# Altium schematic sheet Safe.SchDoc
size A2
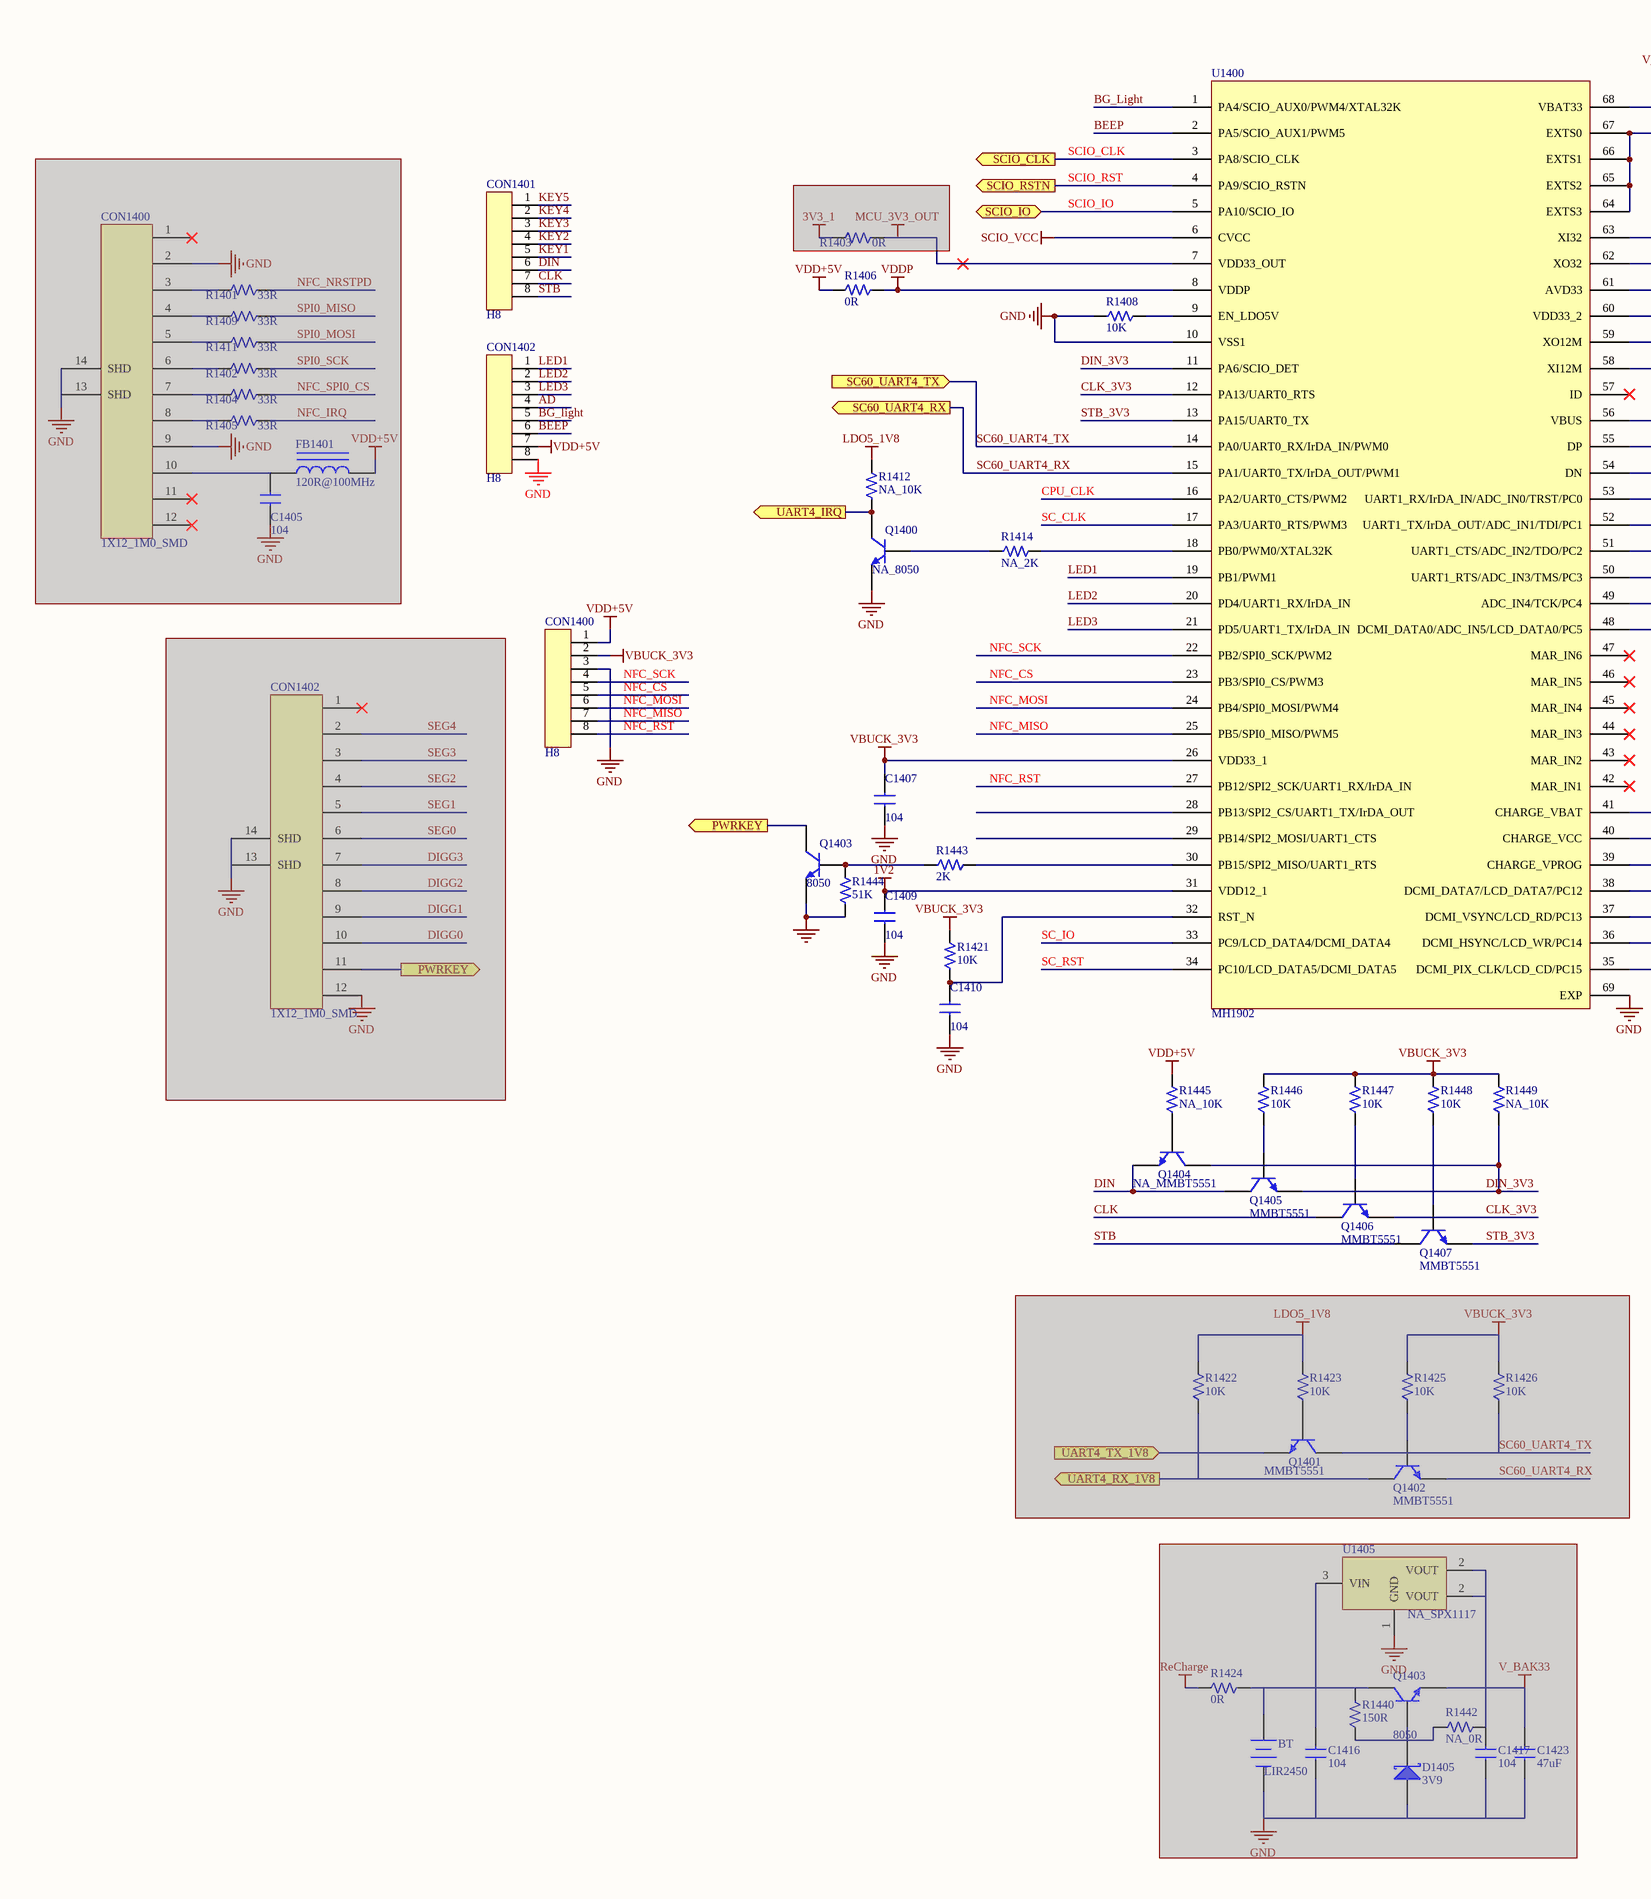
[diagram p0: Safe.SchDoc, left]
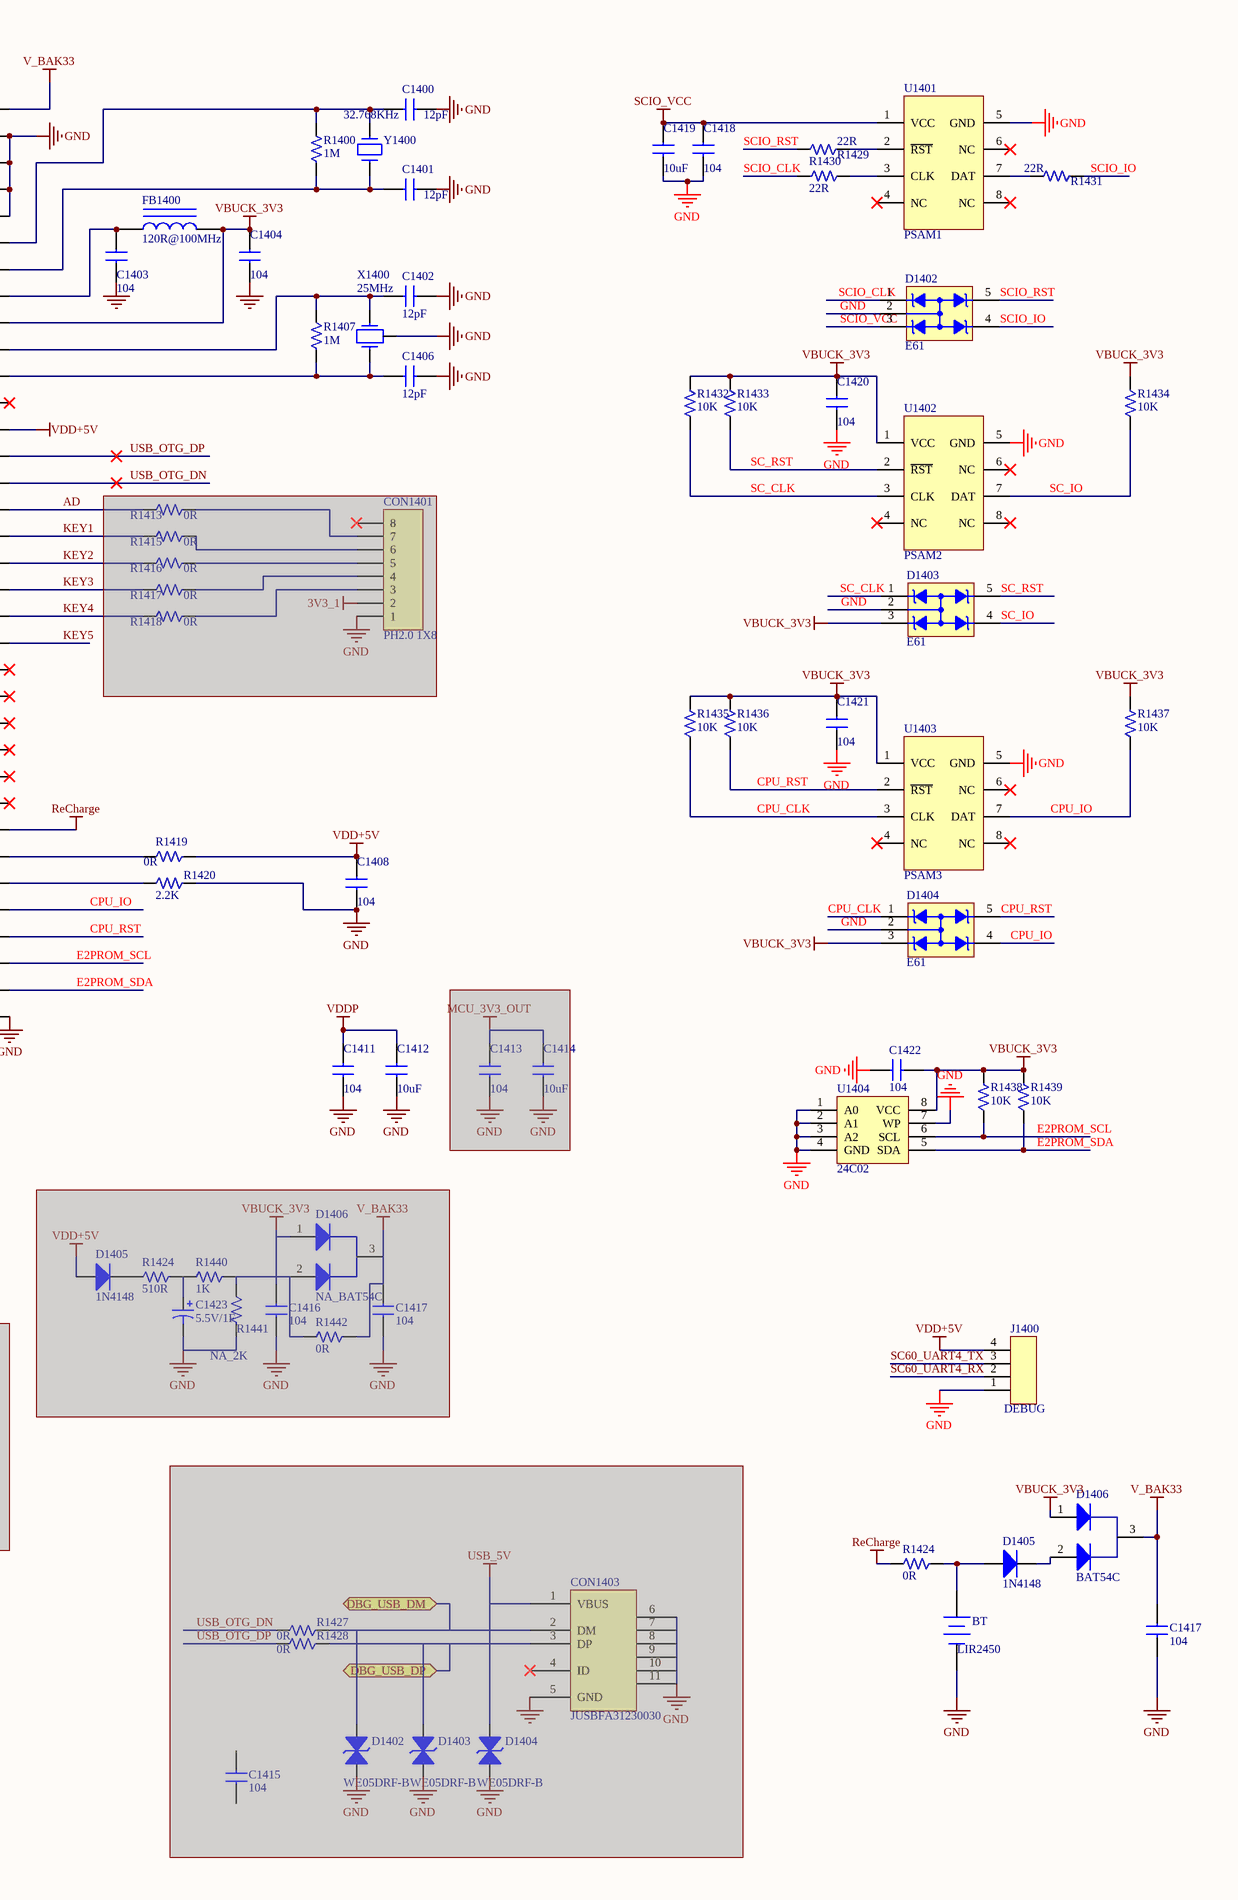
[diagram p1: Safe.SchDoc, right]

## Parts
(Parts that share a designator on the sheet are numbered #1, #2 ... from top to bottom, then left to right.)
BT#1  LIR2450  [LIR2450]
BT#2  LIR2450  [BAT-2]  (masked out: inside a compile mask, not in the netlist)
C1400  12pF  [C0603]
C1401  12pF  [C0603]
C1402  12pF  [C0603]
C1403  104  [C0603]
C1404  104  [C0603]
C1405  104  [C0603]  (masked out: inside a compile mask, not in the netlist)
C1406  12pF  [C0603]
C1407  104  [C0603]
C1408  104  [C0603]
C1409  104  [C0603]
C1410  104  [C0603]
C1411  104  [C0603]
C1412  10uF  [C0603]
C1413  104  [C0603]  (masked out: inside a compile mask, not in the netlist)
C1414  10uF  [C0603]  (masked out: inside a compile mask, not in the netlist)
C1415  104  [C0603]  (masked out: inside a compile mask, not in the netlist)
C1416#1  104  [C0603]  (masked out: inside a compile mask, not in the netlist)
C1416#2  104  [C0603]  (masked out: inside a compile mask, not in the netlist)
C1417#1  104  [C0603]  (masked out: inside a compile mask, not in the netlist)
C1417#2  104  [C0603]
C1417#3  104  [C0603]  (masked out: inside a compile mask, not in the netlist)
C1418  104  [C0603]
C1419  10uF  [C0603]
C1420  104  [C0603]
C1421  104  [C0603]
C1422  104  [C0603]
C1423#1  5.5V/1F  [KAMCAP20.7*7.4_6mm]  (masked out: inside a compile mask, not in the netlist)
C1423#2  47uF  [C0805]  (masked out: inside a compile mask, not in the netlist)
CON1400#1  1X12_1M0_SMD  (masked out: inside a compile mask, not in the netlist)
CON1400#2  H8  [1.25-8P-LT]
CON1401#1  H8  [1.25-8P-LT]
CON1401#2  PH2.0 1X8  [HDR1X8]  (masked out: inside a compile mask, not in the netlist)
CON1402#1  H8  [1.25-8P-LT]
CON1402#2  1X12_1M0_SMD  (masked out: inside a compile mask, not in the netlist)
CON1403  JUSBFA31230030  (masked out: inside a compile mask, not in the netlist)
D1402#1  E61  [SOT23-5]
D1402#2  WE05DRF-B  [DO-214AB(SMC)]  (masked out: inside a compile mask, not in the netlist)
D1403#1  E61  [SOT23-5]
D1403#2  WE05DRF-B  [DO-214AB(SMC)]  (masked out: inside a compile mask, not in the netlist)
D1404#1  E61  [SOT23-5]
D1404#2  WE05DRF-B  [DO-214AB(SMC)]  (masked out: inside a compile mask, not in the netlist)
D1405#1  1N4148  [LL-34]  (masked out: inside a compile mask, not in the netlist)
D1405#2  1N4148  [LL-34]
D1405#3  3V9  [LL-34]  (masked out: inside a compile mask, not in the netlist)
D1406#1  NA_BAT54C  [SOT-23]  (masked out: inside a compile mask, not in the netlist)
D1406#2  BAT54C  [SOT-23]
FB1400  120R@100MHz  [R0603]
FB1401  120R@100MHz  [R0603]  (masked out: inside a compile mask, not in the netlist)
J1400  DEBUG  [Hs4_2.0]
Q1400  NA_8050  [SOT-23]
Q1401  MMBT5551  [SOT-23]  (masked out: inside a compile mask, not in the netlist)
Q1402  MMBT5551  [SOT-23]  (masked out: inside a compile mask, not in the netlist)
Q1403#1  8050  [SOT-23]
Q1403#2  8050  [SOT-23]  (masked out: inside a compile mask, not in the netlist)
Q1404  NA_MMBT5551  [SOT-23]
Q1405  MMBT5551  [SOT-23]
Q1406  MMBT5551  [SOT-23]
Q1407  MMBT5551  [SOT-23]
R1400  1M  [R0603]
R1401  33R  [R0603]  (masked out: inside a compile mask, not in the netlist)
R1402  33R  [R0603]  (masked out: inside a compile mask, not in the netlist)
R1403  0R  [R0603]  (masked out: inside a compile mask, not in the netlist)
R1404  33R  [R0603]  (masked out: inside a compile mask, not in the netlist)
R1405  33R  [R0603]  (masked out: inside a compile mask, not in the netlist)
R1406  0R  [R0603]
R1407  1M  [R0603]
R1408  10K  [R0603]
R1409  33R  [R0603]  (masked out: inside a compile mask, not in the netlist)
R1411  33R  [R0603]  (masked out: inside a compile mask, not in the netlist)
R1412  NA_10K  [R0603]
R1413  0R  [R0603]  (masked out: inside a compile mask, not in the netlist)
R1414  NA_2K  [R0603]
R1415  0R  [R0603]  (masked out: inside a compile mask, not in the netlist)
R1416  0R  [R0603]  (masked out: inside a compile mask, not in the netlist)
R1417  0R  [R0603]  (masked out: inside a compile mask, not in the netlist)
R1418  0R  [R0603]  (masked out: inside a compile mask, not in the netlist)
R1419  0R  [R0603]
R1420  2.2K  [R0603]
R1421  10K  [R0603]
R1422  10K  [R0603]  (masked out: inside a compile mask, not in the netlist)
R1423  10K  [R0603]  (masked out: inside a compile mask, not in the netlist)
R1424#1  510R  [R0603]  (masked out: inside a compile mask, not in the netlist)
R1424#2  0R  [R0603]
R1424#3  0R  [R0603]  (masked out: inside a compile mask, not in the netlist)
R1425  10K  [R0603]  (masked out: inside a compile mask, not in the netlist)
R1426  10K  [R0603]  (masked out: inside a compile mask, not in the netlist)
R1427  0R  [R0603]  (masked out: inside a compile mask, not in the netlist)
R1428  0R  [R0603]  (masked out: inside a compile mask, not in the netlist)
R1429  22R  [R0603]
R1430  22R  [R0603]
R1431  22R  [R0603]
R1432  10K  [R0603]
R1433  10K  [R0603]
R1434  10K  [R0603]
R1435  10K  [R0603]
R1436  10K  [R0603]
R1437  10K  [R0603]
R1438  10K  [R0603]
R1439  10K  [R0603]
R1440#1  1K  [R0603]  (masked out: inside a compile mask, not in the netlist)
R1440#2  150R  [R0603]  (masked out: inside a compile mask, not in the netlist)
R1441  NA_2K  [R0603]  (masked out: inside a compile mask, not in the netlist)
R1442#1  0R  [R0603]  (masked out: inside a compile mask, not in the netlist)
R1442#2  NA_0R  [R0603]  (masked out: inside a compile mask, not in the netlist)
R1443  2K  [R0603]
R1444  51K  [R0603]
R1445  NA_10K  [R0603]
R1446  10K  [R0603]
R1447  10K  [R0603]
R1448  10K  [R0603]
R1449  NA_10K  [R0603]
U1400  MH1902  [QFN68]
U1401  PSAM1  [PSAM/SIM]
U1402  PSAM2  [PSAM/SIM]
U1403  PSAM3  [PSAM/SIM]
U1404  24C02  [SO127P-390-8]
U1405  NA_SPX1117  [SOT-223]  (masked out: inside a compile mask, not in the netlist)
X1400  25MHz  [XTAL3225_SMT]
Y1400  32.768KHz  [XTAL3215_SMT]

## Ports
DBG_USB_DM (bidir), DBG_USB_DP (bidir), PWRKEY (out), SC60_UART4_RX (out), SC60_UART4_TX (in), SCIO_CLK (out), SCIO_IO (bidir), SCIO_RSTN (out), UART4_IRQ (out), UART4_RX_1V8 (out), UART4_TX_1V8 (in)

## Nets
1V2: C1409.2 U1400.31(VDD12_1)
GND: BT#1.2(-) C1400.2 C1401.2 C1402.2 C1403.1 C1404.1 C1406.2 C1407.1 C1408.1 C1409.1 C1410.1 C1411.1 C1412.1 C1417#2.2 C1418.1 C1419.1 C1420.1 C1421.1 C1422.2 CON1400#2.3 CON1402#1.8 D1402#1.2 D1403#1.2 D1404#1.2 J1400.1 Q1400.2(E) Q1403#1.2(E) R1408.1 R1420.1 R1444.1 U1400.10(VSS1) U1400.64(EXTS3) U1400.65(EXTS2) U1400.66(EXTS1) U1400.67(EXTS0) U1400.69(EXP) U1401.5(GND) U1402.5(GND) U1403.5(GND) U1404.1(A0) U1404.2(A1) U1404.3(A2) U1404.4(GND) U1404.7(WP) X1400.2(GND)
LDO5_1V8: R1412.2
ReCharge: R1424#2.2 U1400.41(CHARGE_VBAT)
SCIO_VCC: C1418.2 C1419.2 D1402#1.3 U1400.6(CVCC) U1401.1(VCC)
V_BAK33: C1417#2.1 D1406#2.3(K) U1400.68(VBAT33)
VBUCK_3V3: C1404.2 C1407.2 C1420.2 C1421.2 C1422.1 CON1400#2.2 D1403#1.3 D1404#1.3 D1406#2.1(A) FB1400.2 R1421.2 R1432.1 R1433.1 R1434.1 R1435.1 R1436.1 R1437.1 R1438.1 R1439.1 R1446.2 R1447.2 R1448.2 R1449.2 U1400.26(VDD33_1) U1400.60(VDD33_2) U1402.1(VCC) U1403.1(VCC) U1404.8(VCC)
VDD+5V: C1408.2 CON1400#2.1 CON1402#1.7 J1400.4 R1406.2 R1419.1 R1445.2 U1400.56(VBUS)
VDDP: C1411.2 C1412.2 R1406.1 U1400.8(VDDP)
AD: CON1402#1.4 U1400.53(UART1_RX/IrDA_IN/ADC_IN0/TRST/PC0)
BEEP: CON1402#1.6 U1400.2(PA5/SCIO_AUX1/PWM5)
BG_Light: CON1402#1.5 U1400.1(PA4/SCIO_AUX0/PWM4/XTAL32K)
CLK: CON1401#1.7 Q1406.3(C)
CLK_3V3: Q1406.2(E) U1400.12(PA13/UART0_RTS)
CPU_CLK: D1404#1.1 R1435.2 U1400.16(PA2/UART0_CTS/PWM2) U1403.3(CLK)
CPU_IO: D1404#1.4 R1437.2 U1400.38(DCMI_DATA7/LCD_DATA7/PC12) U1403.7(DAT)
CPU_RST: D1404#1.5 R1436.2 U1400.37(DCMI_VSYNC/LCD_RD/PC13) U1403.2(~{RST})
DIN: CON1401#1.6 Q1404.2(E) Q1405.3(C)
DIN_3V3: Q1404.3(C) Q1405.2(E) R1449.1 U1400.11(PA6/SCIO_DET)
E2PROM_SCL: R1438.2 U1400.36(DCMI_HSYNC/LCD_WR/PC14) U1404.6(SCL)
E2PROM_SDA: R1439.2 U1400.35(DCMI_PIX_CLK/LCD_CD/PC15) U1404.5(SDA)
KEY1: CON1401#1.5 U1400.52(UART1_TX/IrDA_OUT/ADC_IN1/TDI/PC1)
KEY2: CON1401#1.4 U1400.51(UART1_CTS/ADC_IN2/TDO/PC2)
KEY3: CON1401#1.3 U1400.50(UART1_RTS/ADC_IN3/TMS/PC3)
KEY4: CON1401#1.2 U1400.49(ADC_IN4/TCK/PC4)
KEY5: CON1401#1.1 U1400.48(DCMI_DATA0/ADC_IN5/LCD_DATA0/PC5)
LED1: CON1402#1.1 U1400.19(PB1/PWM1)
LED2: CON1402#1.2 U1400.20(PD4/UART1_RX/IrDA_IN)
LED3: CON1402#1.3 U1400.21(PD5/UART1_TX/IrDA_IN)
NFC_CS: CON1400#2.5 U1400.23(PB3/SPI0_CS/PWM3)
NFC_MISO: CON1400#2.7 U1400.25(PB5/SPI0_MISO/PWM5)
NFC_MOSI: CON1400#2.6 U1400.24(PB4/SPI0_MOSI/PWM4)
NFC_RST: CON1400#2.8 U1400.27(PB12/SPI2_SCK/UART1_RX/IrDA_IN)
NFC_SCK: CON1400#2.4 U1400.22(PB2/SPI0_SCK/PWM2)
PWRKEY: Q1403#1.3(C) ; port PWRKEY
SC60_UART4_RX: J1400.2 U1400.15(PA1/UART0_TX/IrDA_OUT/PWM1) ; port SC60_UART4_RX
SC60_UART4_TX: J1400.3 U1400.14(PA0/UART0_RX/IrDA_IN/PWM0) ; port SC60_UART4_TX
SC_CLK: D1403#1.1 R1432.2 U1400.17(PA3/UART0_RTS/PWM3) U1402.3(CLK)
SC_IO: D1403#1.4 R1434.2 U1400.33(PC9/LCD_DATA4/DCMI_DATA4) U1402.7(DAT)
SC_RST: D1403#1.5 R1433.2 U1400.34(PC10/LCD_DATA5/DCMI_DATA5) U1402.2(~{RST})
SCIO_CLK: D1402#1.1 R1430.1 U1400.3(PA8/SCIO_CLK) ; port SCIO_CLK
SCIO_IO: D1402#1.4 R1431.1 U1400.5(PA10/SCIO_IO) ; port SCIO_IO
SCIO_RST: D1402#1.5 R1429.2 U1400.4(PA9/SCIO_RSTN) ; port SCIO_RSTN
STB: CON1401#1.8 Q1407.3(C)
STB_3V3: Q1407.2(E) U1400.13(PA15/UART0_TX)
UART4_IRQ: Q1400.3(C) R1412.1 ; port UART4_IRQ
USB_OTG_DN: U1400.54(DN)
USB_OTG_DP: U1400.55(DP)
NetBT#1_1: BT#1.1(+) D1405#2.1(A) R1424#2.1
NetC1400_1: C1400.1 R1400.2 U1400.63(XI32) Y1400.2
NetC1401_1: C1401.1 R1400.1 U1400.62(XO32) Y1400.1
NetC1402_1: C1402.1 R1407.2 U1400.59(XO12M) X1400.1
NetC1403_2: C1403.2 FB1400.1 U1400.61(AVD33)
NetC1406_1: C1406.1 R1407.1 U1400.58(XI12M) X1400.3
NetC1410_2: C1410.2 R1421.1 U1400.32(RST_N)
NetD1405#2_2: D1405#2.2(K) D1406#2.2(A)
NetQ1400_1: Q1400.1(B) R1414.1
NetQ1403#1_1: Q1403#1.1(B) R1443.1 R1444.2
NetQ1404_1: Q1404.1(B) R1445.1
NetQ1405_1: Q1405.1(B) R1446.1
NetQ1406_1: Q1406.1(B) R1447.1
NetQ1407_1: Q1407.1(B) R1448.1
NetR1408_2: R1408.2 U1400.9(EN_LDO5V)
NetR1414_2: R1414.2 U1400.18(PB0/PWM0/XTAL32K)
NetR1419_2: R1419.2 U1400.40(CHARGE_VCC)
NetR1420_2: R1420.2 U1400.39(CHARGE_VPROG)
NetR1429_1: R1429.1 U1401.2(~{RST})
NetR1430_2: R1430.2 U1401.3(CLK)
NetR1431_2: R1431.2 U1401.7(DAT)
NetR1443_2: R1443.2 U1400.30(PB15/SPI2_MISO/UART1_RTS)

Not connected (* = marked no-connect by the designer): U1400 7(VDD33_OUT)* 28(PB13/SPI2_CS/UART1_TX/IrDA_OUT) 29(PB14/SPI2_MOSI/UART1_CTS) 42(MAR_IN1)* 43(MAR_IN2)* 44(MAR_IN3)* 45(MAR_IN4)* 46(MAR_IN5)* 47(MAR_IN6)* 57(ID)*; U1401 4(NC)* 6(NC)* 8(NC)*; U1402 4(NC)* 6(NC)* 8(NC)*; U1403 4(NC)* 6(NC)* 8(NC)*

## Library data of the parts
BT#1 BT#2 = Battery: Multicell Battery; Published: 24-Mar-1999; LatestRevisionDate: 17-Jul-2002; LatestRevisionNote: Re-released for DXP Platform.; PackageReference: BAT-2; Publisher: Altium Limited; PackageDescription: Battery; 2 Leads
C1400-C1415 C1416#1 C1416#2 C1417#1-C1417#3 C1418-C1422 C1423#2 = C: Capacitance
C1423#1 = Cap Pol: Polarized Capacitor; Value: 476A; Published: 8-Jun-2000; LatestRevisionDate: 17-Jul-2002; LatestRevisionNote: Re-released for DXP Platform.; PackageReference: RB7.6-15; Publisher: Altium Limited
CON1401#2 = Header 8: Header, 8-Pin; LatestRevisionDate: 17-Jul-2002; LatestRevisionNote: Re-released for DXP Platform.; Publisher: Altium Limited
D1402#1 D1403#1 D1404#1 = ESDA6V1W5(E61)
D1402#2 D1403#2 D1404#2 = TVS: Transient Voltage Suppressor; Part No.: BK0012019
D1405#1 D1405#2 = D1: Manufacturer: Generic Components; Class: Discrete; SubClass: Diode - Switching; Published: 08/06/2000; Publisher: Altium Hobart Technology Centre
D1405#3 = Diode BAS70: Silicon AF Schottky Diode for High-Speed Switching; Note: Pin 2 is not connected and not drawn.; Published: 21-Mar-2003; LatestRevisionDate: 29-May-2009; LatestRevisionNote: IPC-7351 Footprint Added.; DatasheetVersion: Oct-1999; PackageVersion: Sep-2001; PackageReference: SOT-23; Publisher: Altium Limited; PackageDescription: 3-Pin SOT-23 Package 0.95 mm Pitch, 2.5 mm Lead Span; ComponentLink1Description: Manufacturer Link; ComponentLink1URL: http://www.infineon.com/; ComponentLink2Description: Datasheet; ComponentLink2URL: http://www.infineon.com/upload/Document/cmc_upload/documents/009/382/bas40_bas140series_1.pdf
D1406#1 = BAT54C
FB1400 FB1401 = Inductor Iron: Magnetic-Core Inductor; Value: 10mH; Published: 24-Mar-1999; LatestRevisionDate: 17-Jul-2002; LatestRevisionNote: Re-released for DXP Platform.; PackageReference: AXIAL-0.9; Publisher: Altium Limited; PackageDescription: Axial Device, Thru-Hole; 2 Leads; 0.9 in Pin Spacing
J1400 = H4
Q1400-Q1402 Q1403#1 Q1403#2 Q1404-Q1407 = 2N3904: NPN General Purpose Amplifier; Published: 8-Jun-2000; LatestRevisionDate: 15-Jan-2003; LatestRevisionNote: PCB Footprint 'BCY-W3/D4.7' replaced; DatasheetVersion: 1997; PackageVersion: Sep-1998; PackageReference: TO-92A; Publisher: Altium Limited; PackageDescription: TO, Flat Index; 3 In-Line, Axial Leads; Body Dia. 4.5mm; Leads 0.51 x 0.48 mm (max); ComponentLink1Description: Manufacturer Link; ComponentLink1URL: http://www.fairchildsemi.com/; ComponentLink2Description: Datasheet; ComponentLink2URL: http://www.fairchildsemi.com/ds/2N%2F2N3904.pdf
R1400-R1409 R1411-R1423 R1424#1-R1424#3 R1425-R1439 R1440#1 R1440#2 R1441 R1442#1 R1442#2 R1443-R1449 = R: Resistance
U1401-U1403 = PSAM/SIM
U1404 = 24C512
U1405 = SPX1117: 800mA Low Dropout Voltage Regulator
X1400 = CX1
Y1400 = CX: pin to pad: 2>3